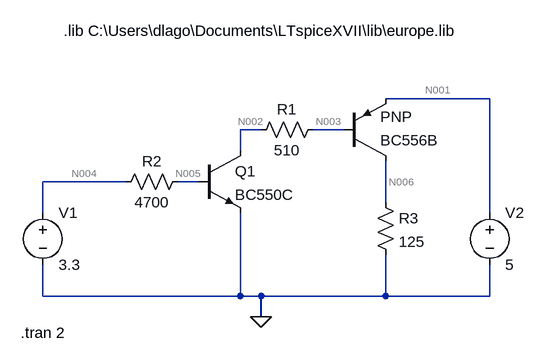
[diagram p0: schematic HC06_npn_pnp.asc]
HC06_npn_pnp.asc, the LTspice schematic file:
Version 4
SHEET 1 880 680
WIRE 560 48 400 48
WIRE 208 96 176 96
WIRE 336 96 288 96
WIRE 176 128 176 96
WIRE 0 176 -128 176
WIRE 112 176 80 176
WIRE 400 208 400 144
WIRE -128 224 -128 176
WIRE 560 224 560 48
WIRE -128 352 -128 304
WIRE 176 352 176 224
WIRE 176 352 -128 352
WIRE 208 352 176 352
WIRE 400 352 400 288
WIRE 400 352 208 352
WIRE 560 352 560 304
WIRE 560 352 400 352
WIRE 208 384 208 352
FLAG 208 384 0
SYMBOL npn 112 128 R0
SYMATTR InstName Q1
SYMATTR Value BC550C
SYMBOL pnp 336 144 M180
SYMATTR InstName BC556B
SYMBOL res 304 80 R90
WINDOW 0 0 56 VBottom 2
WINDOW 3 32 56 VTop 2
SYMATTR InstName R1
SYMATTR Value 510
SYMBOL res 96 160 R90
WINDOW 0 0 56 VBottom 2
WINDOW 3 32 56 VTop 2
SYMATTR InstName R2
SYMATTR Value 4700
SYMBOL voltage -128 208 R0
WINDOW 123 0 0 Left 0
WINDOW 39 0 0 Left 0
SYMATTR InstName V1
SYMATTR Value 3.3
SYMBOL voltage 560 208 R0
WINDOW 123 0 0 Left 0
WINDOW 39 0 0 Left 0
SYMATTR InstName V2
SYMATTR Value 5
SYMBOL res 384 192 R0
SYMATTR InstName R3
SYMATTR Value 125
TEXT -162 408 Left 2 !.tran 2
TEXT -96 -56 Left 2 !.lib C:\\Users\\dlago\\Documents\\LTspiceXVII\\lib\\europe.lib

The netlist it stands for:
* HC06_npn_pnp.asc
Q1 N002 N005 0 0 BC550C
Q§BC556B N006 N003 N001 0 PNP
R1 N003 N002 510
R2 N005 N004 4700
V1 N004 0 3.3
V2 N001 0 5
R3 N006 0 125
.model NPN NPN
.model PNP PNP
.lib standard.bjt
.tran 2
.lib C:\Users\dlago\Documents\LTspiceXVII\lib\europe.lib
.backanno
.end

* Results of the author's LTspice run, read from the files saved beside the schematic
* Operating Point, zero values left out:
*   V(n002) = 70.14 mV
*   V(n005) = 724.8 mV
*   V(n006) = 4.948 V
*   V(n003) = 4.122 V
*   V(n001) = 5 V
*   V(n004) = 3.3 V
*   Ic(Bc556b) = -39.59 mA
*   Ib(Bc556b) = -7.946 mA
*   Ie(Bc556b) = 47.53 mA
*   Ic(Q1) = 7.946 mA
*   Ib(Q1) = 547.9 µA
*   Ie(Q1) = -8.494 mA
*   I(R3) = 39.59 mA
*   I(R2) = -547.9 µA
*   I(R1) = 7.946 mA
*   I(V2) = -47.53 mA
*   I(V1) = -547.9 µA
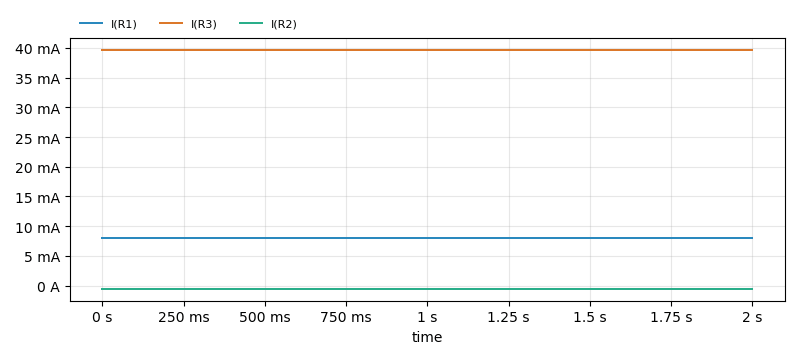
[diagram p1: Transient Analysis of HC06_npn_pnp.asc, plotted from the saved traces]
* Transient Analysis, 1 run:
*   I(R1): min 7.946 mA, max 7.946 mA, average 7.946 mA, rms 7.946 mA, last 7.946 mA
*   I(R3): min 39.59 mA, max 39.59 mA, average 39.59 mA, rms 39.59 mA, last 39.59 mA
*   I(R2): min -547.9 µA, max -547.9 µA, average -547.9 µA, rms 547.9 µA, last -547.9 µA